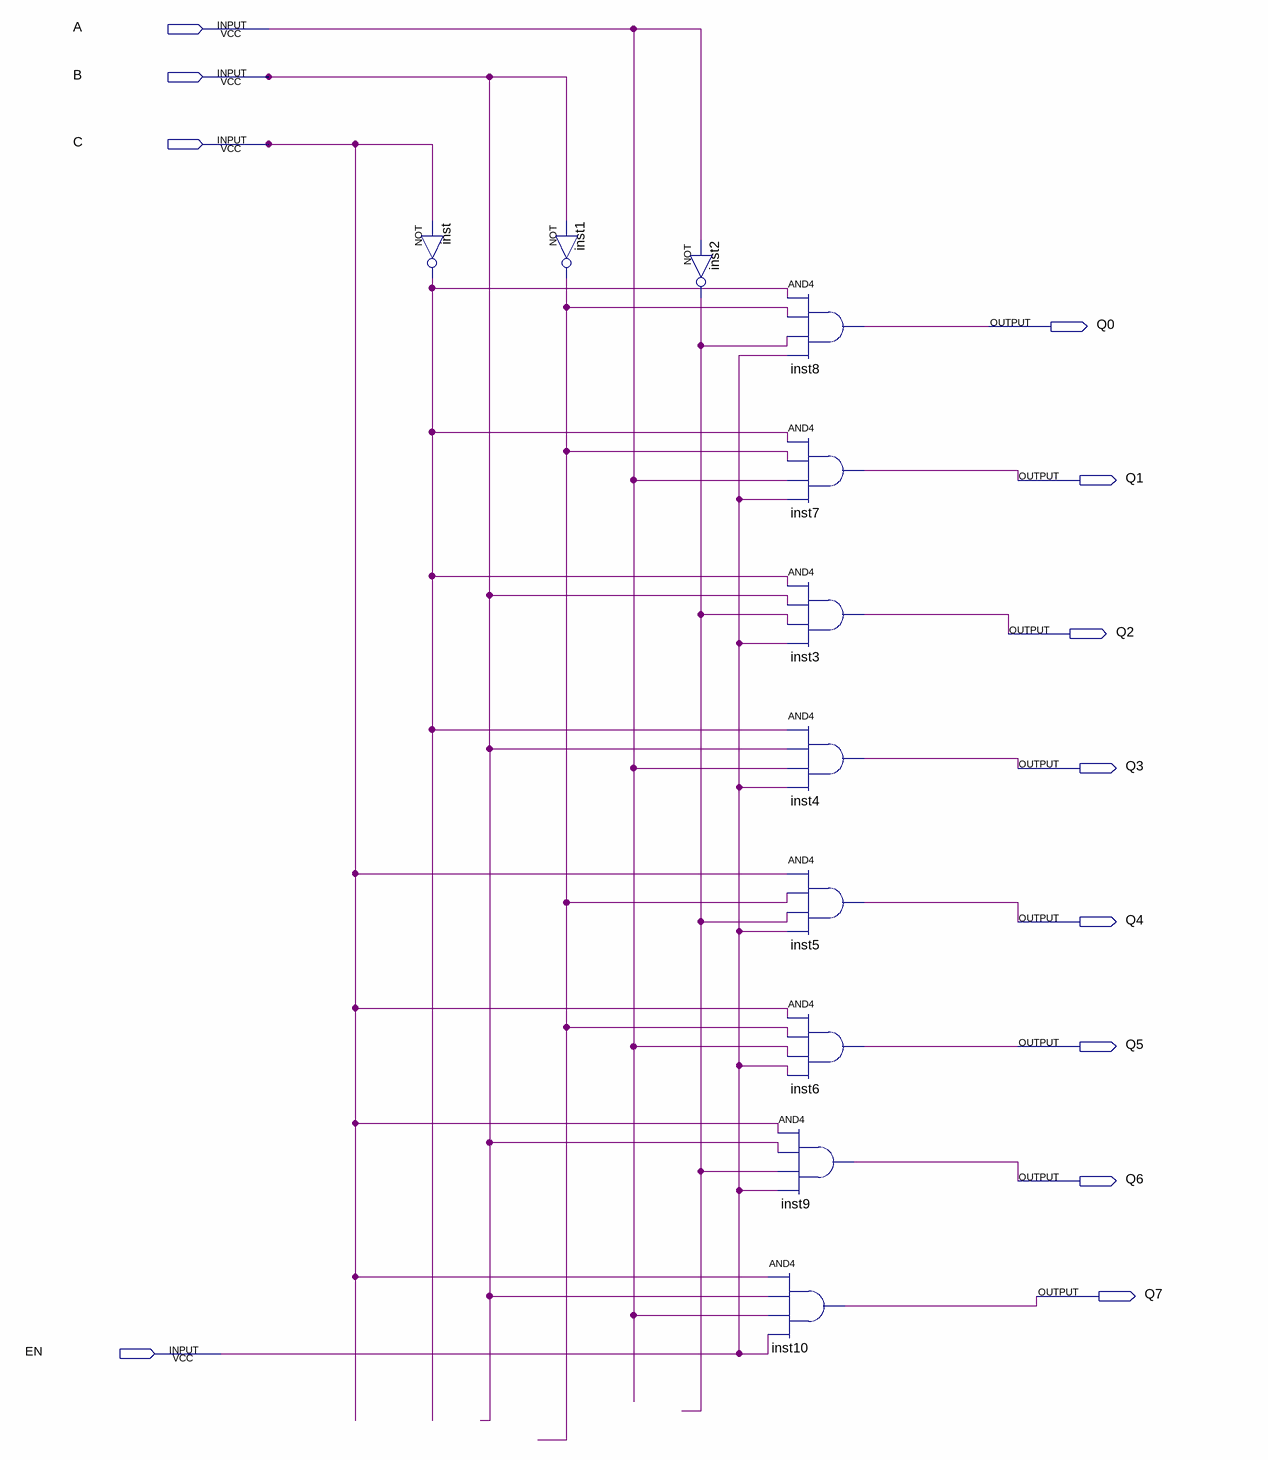
[diagram p0: schematic sheet]
// Quartus schematic hwhw.bdf as structural Verilog: 11 symbols, 12 pins
module hwhw (
  input  A,
  input  B,
  input  C,
  input  EN,
  output Q0,
  output Q1,
  output Q2,
  output Q3,
  output Q4,
  output Q5,
  output Q6,
  output Q7
);

  wire inst1_out, inst2_out, inst_out;

  not inst (inst_out, C);
  not inst1 (inst1_out, B);
  not inst2 (inst2_out, A);
  and inst8 (Q0, inst_out, inst1_out, inst2_out, EN);
  and inst7 (Q1, inst_out, inst1_out, A, EN);
  and inst3 (Q2, inst_out, B, inst2_out, EN);
  and inst4 (Q3, inst_out, B, A, EN);
  and inst5 (Q4, C, inst1_out, inst2_out, EN);
  and inst6 (Q5, C, inst1_out, A, EN);
  and inst9 (Q6, C, B, inst2_out, EN);
  and inst10 (Q7, C, B, A, EN);
endmodule
